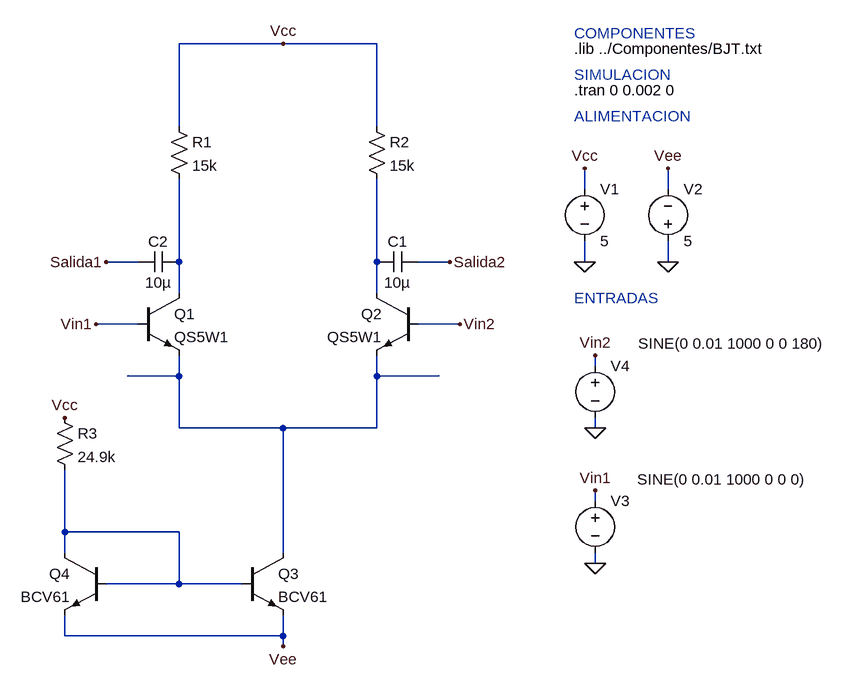
[diagram p0: schematic simulacion.asc]
simulacion.asc, the LTspice schematic file:
Version 4
SHEET 1 1252 828
WIRE 32 -240 -128 -240
WIRE 176 -240 32 -240
WIRE 176 -176 176 -240
WIRE -128 -160 -128 -240
WIRE -128 -112 -128 -160
WIRE 176 -112 176 -176
WIRE 496 -16 496 -48
WIRE 624 -16 624 -48
WIRE 176 48 176 -32
WIRE -192 96 -240 96
WIRE -128 96 -128 -32
WIRE 176 96 176 48
WIRE 288 96 240 96
WIRE 496 96 496 64
WIRE 624 96 624 64
WIRE -128 144 -128 96
WIRE 176 144 176 96
WIRE -192 192 -256 192
WIRE 304 192 240 192
WIRE 512 256 512 240
WIRE -128 272 -128 240
WIRE -128 272 -208 272
WIRE 176 272 176 240
WIRE 272 272 176 272
WIRE -128 352 -128 272
WIRE 32 352 -128 352
WIRE 176 352 176 272
WIRE 176 352 32 352
WIRE 512 352 512 336
WIRE -304 448 -304 416
WIRE 32 464 32 352
WIRE 512 464 512 448
WIRE -304 512 -304 448
WIRE -128 512 -304 512
WIRE -304 544 -304 512
WIRE -128 544 -128 512
WIRE 32 544 32 464
WIRE 512 560 512 544
WIRE -128 592 -128 544
WIRE -128 592 -240 592
WIRE -32 592 -128 592
WIRE -304 672 -304 640
WIRE 32 672 32 640
WIRE 32 672 -304 672
WIRE 32 688 32 672
FLAG 496 96 0
FLAG 624 96 0
FLAG 496 -48 Vcc
FLAG 624 -48 Vee
FLAG 32 -240 Vcc
FLAG 32 688 Vee
FLAG -304 336 Vcc
FLAG 512 352 0
FLAG 512 560 0
FLAG -256 192 Vin1
FLAG 512 448 Vin1
FLAG 512 240 Vin2
FLAG 304 192 Vin2
FLAG 288 96 Salida2
FLAG -240 96 Salida1
DATAFLAG -208 272 ""
DATAFLAG 272 272 ""
DATAFLAG -64 384 "Ie(Q1)"
DATAFLAG 128 384 "Ie(Q2)"
DATAFLAG 32 464 "Ic(Q3)"
DATAFLAG 176 48 ""
DATAFLAG 176 -176 "I(R2)"
DATAFLAG -304 448 "I(R3)"
DATAFLAG -128 544 "Ib(Q4)"
DATAFLAG -128 -160 "I(R1)"
SYMBOL npn -192 144 R0
SYMATTR InstName Q1
SYMATTR Value QS5W1
SYMBOL npn 240 144 M0
SYMATTR InstName Q2
SYMATTR Value QS5W1
SYMBOL voltage 496 -32 R0
WINDOW 123 0 0 Left 2
WINDOW 39 0 0 Left 2
SYMATTR InstName V1
SYMATTR Value 5
SYMBOL voltage 624 80 M180
WINDOW 0 24 96 Left 2
WINDOW 3 24 16 Left 2
WINDOW 123 0 0 Left 2
WINDOW 39 0 0 Left 2
SYMATTR InstName V2
SYMATTR Value 5
SYMBOL voltage 512 448 R0
WINDOW 3 65 -17 Left 2
WINDOW 123 0 0 Left 2
WINDOW 39 0 0 Left 2
SYMATTR Value SINE(0 0.01 1000 0 0 0)
SYMATTR InstName V3
SYMBOL voltage 512 240 R0
WINDOW 3 66 -18 Left 2
WINDOW 123 0 0 Left 2
WINDOW 39 0 0 Left 2
SYMATTR Value SINE(0 0.01 1000 0 0 180)
SYMATTR InstName V4
SYMBOL npn -32 544 R0
SYMATTR InstName Q3
SYMATTR Value BCV61
SYMBOL npn -240 544 M0
SYMATTR InstName Q4
SYMATTR Value BCV61
SYMBOL res -144 -128 R0
SYMATTR InstName R1
SYMATTR Value 15k
SYMBOL res 160 -128 R0
SYMATTR InstName R2
SYMATTR Value 15k
SYMBOL res -320 320 R0
SYMATTR InstName R3
SYMATTR Value 24.9k
SYMBOL cap 240 80 R90
WINDOW 0 0 32 VBottom 2
WINDOW 3 32 32 VTop 2
SYMATTR InstName C1
SYMATTR Value 10µ
SYMBOL cap -128 80 R90
WINDOW 0 0 32 VBottom 2
WINDOW 3 32 32 VTop 2
SYMATTR InstName C2
SYMATTR Value 10µ
TEXT 480 -232 Left 2 !.lib ../Componentes/BJT.txt
TEXT 480 -168 Left 2 !.tran 0 0.002 0
TEXT 480 -256 Left 2 ;COMPONENTES
TEXT 480 -192 Left 2 ;SIMULACION
TEXT 480 -128 Left 2 ;ALIMENTACION
TEXT 480 152 Left 2 ;ENTRADAS

The netlist it stands for:
* simulacion.asc
Q1 N002 Vin1 N003 0 QS5W1
Q2 N001 Vin2 N003 0 QS5W1
V1 Vcc 0 5
V2 0 Vee 5
V3 Vin1 0 SINE(0 0.01 1000 0 0 0)
V4 Vin2 0 SINE(0 0.01 1000 0 0 180)
Q3 N003 N004 Vee 0 BCV61
Q4 N004 N004 Vee 0 BCV61
R1 Vcc N002 15k
R2 Vcc N001 15k
R3 Vcc N004 24.9k
C1 Salida2 N001 10µ
C2 N002 Salida1 10µ
.model NPN NPN
.model PNP PNP
.lib standard.bjt
.lib ../Componentes/BJT.txt
.tran 0 0.002 0
* COMPONENTES
* SIMULACION
* ALIMENTACION
* ENTRADAS
.backanno
.end